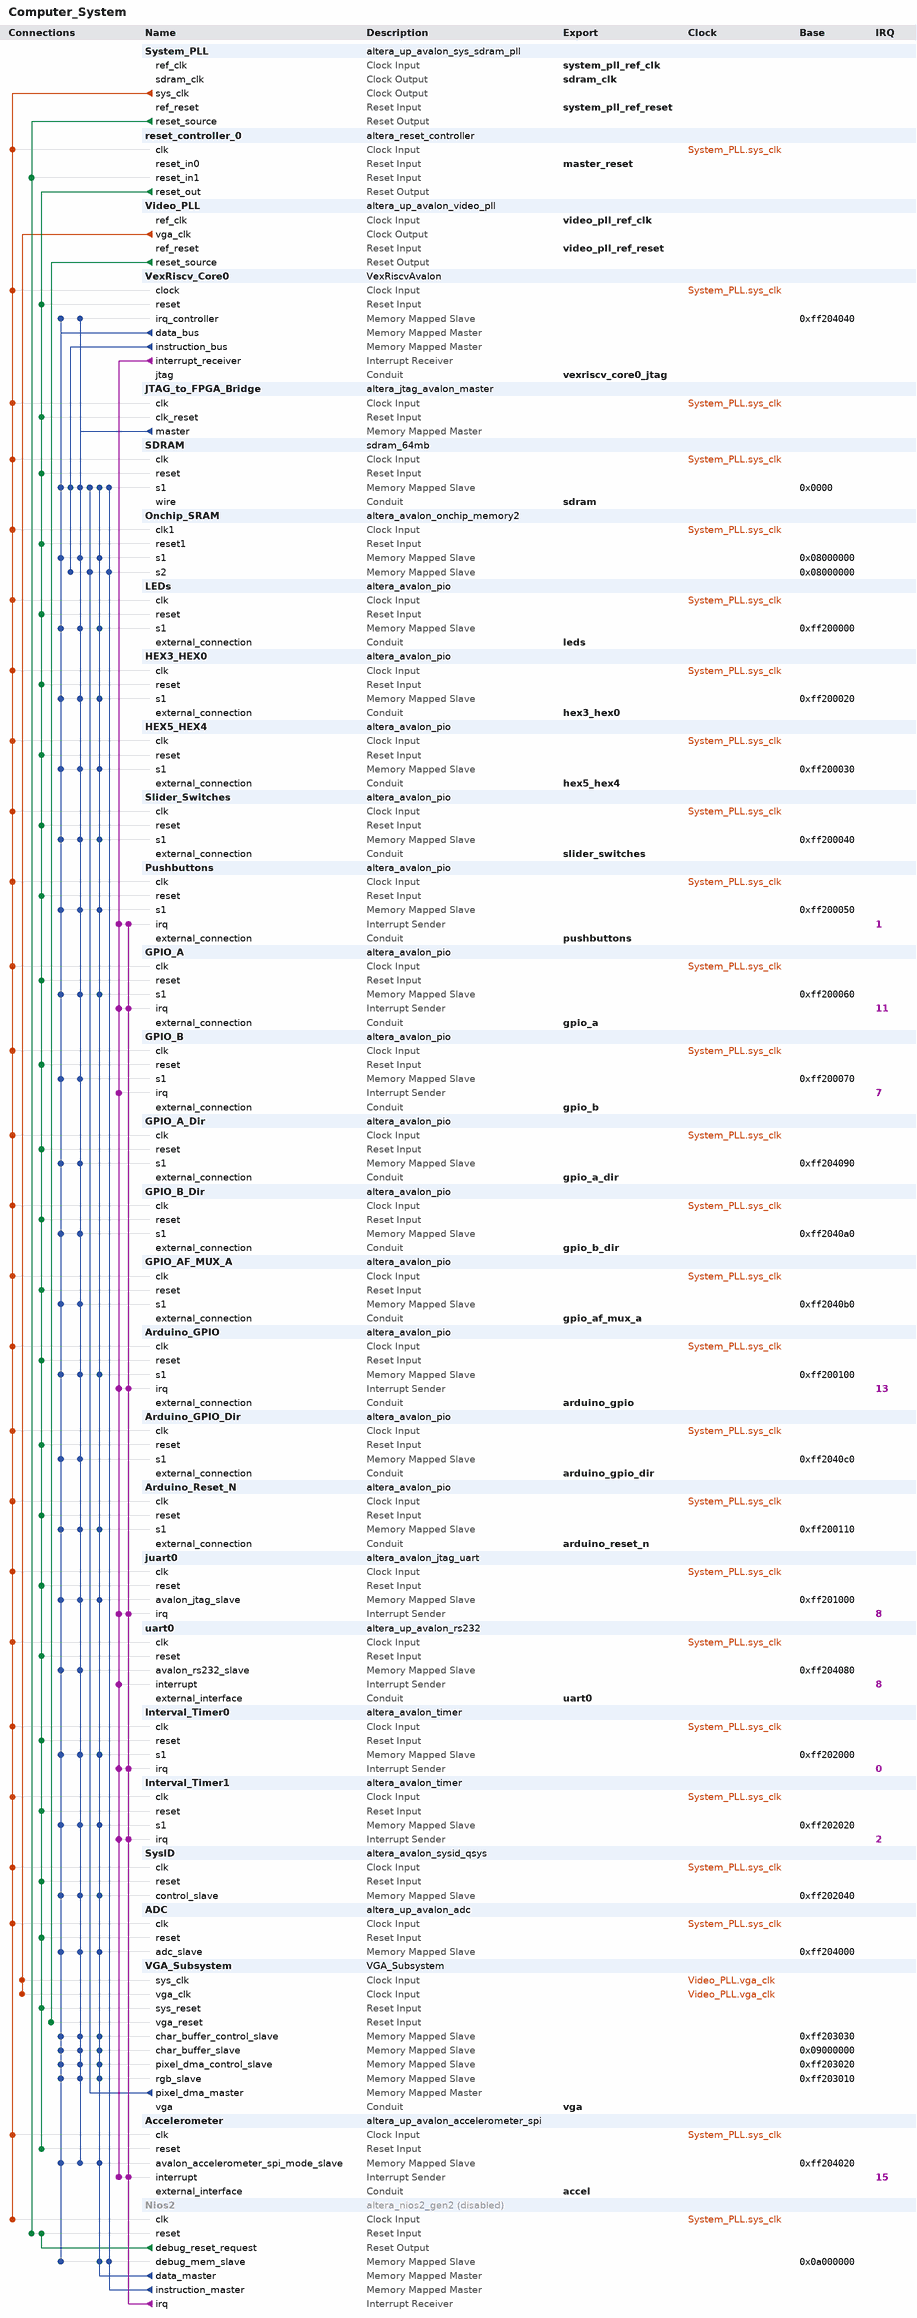
[diagram p0: system contents]
# Platform Designer (Qsys) system Computer_System, MAX 10 10M50DAF484C6GES
# Parameters at their usual value, and those the tool derives, are not listed.
package require -exact qsys 21.1
create_system Computer_System
set_project_property DEVICE_FAMILY {MAX 10}
set_project_property DEVICE 10M50DAF484C6GES

add_instance System_PLL altera_up_avalon_sys_sdram_pll 18.0
set_instance_parameter_value System_PLL CV_boards DE10-Standard
set_instance_parameter_value System_PLL gui_outclk 100.0
set_instance_parameter_value System_PLL gui_refclk 50.0

add_instance reset_controller_0 altera_reset_controller 21.1
set_instance_parameter_value reset_controller_0 NUM_RESET_INPUTS 2
set_instance_parameter_value reset_controller_0 OUTPUT_RESET_SYNC_EDGES both
set_instance_parameter_value reset_controller_0 SYNC_DEPTH 2

add_instance Video_PLL altera_up_avalon_video_pll 18.0
set_instance_parameter_value Video_PLL camera {5MP Digital Camera (THDB_D5M)}
set_instance_parameter_value Video_PLL gui_refclk 50.0
set_instance_parameter_value Video_PLL lcd {7" LCD on VEEK-MT and MTL/MTL2 Modules}

add_instance VexRiscv_Core0 VexRiscvAvalon 1.0
set_instance_parameter_value VexRiscv_Core0 CORE_CONFIG 4
set_instance_parameter_value VexRiscv_Core0 C_EXCEPTION_VECTOR 134217760
set_instance_parameter_value VexRiscv_Core0 C_IO_BEGIN 150994944
set_instance_parameter_value VexRiscv_Core0 C_IO_END 4294967295
set_instance_parameter_value VexRiscv_Core0 C_RESET_VECTOR 134217744

add_instance JTAG_to_FPGA_Bridge altera_jtag_avalon_master 21.1

add_instance SDRAM sdram_64mb 1.0

add_instance Onchip_SRAM altera_avalon_onchip_memory2 21.1
set_instance_parameter_value Onchip_SRAM dataWidth 32
set_instance_parameter_value Onchip_SRAM dualPort true
set_instance_parameter_value Onchip_SRAM initMemContent true
set_instance_parameter_value Onchip_SRAM initializationFileName bootrom.mif
set_instance_parameter_value Onchip_SRAM memorySize 65536
set_instance_parameter_value Onchip_SRAM singleClockOperation true
set_instance_parameter_value Onchip_SRAM useNonDefaultInitFile true

add_instance LEDs altera_avalon_pio 21.1
set_instance_parameter_value LEDs direction Output
set_instance_parameter_value LEDs width 10

add_instance HEX3_HEX0 altera_avalon_pio 21.1
set_instance_parameter_value HEX3_HEX0 direction Output
set_instance_parameter_value HEX3_HEX0 width 32

add_instance HEX5_HEX4 altera_avalon_pio 21.1
set_instance_parameter_value HEX5_HEX4 direction Output
set_instance_parameter_value HEX5_HEX4 width 16

add_instance Slider_Switches altera_avalon_pio 21.1
set_instance_parameter_value Slider_Switches direction Input
set_instance_parameter_value Slider_Switches simDoTestBenchWiring true
set_instance_parameter_value Slider_Switches width 10

add_instance Pushbuttons altera_avalon_pio 21.1
set_instance_parameter_value Pushbuttons bitClearingEdgeCapReg true
set_instance_parameter_value Pushbuttons captureEdge true
set_instance_parameter_value Pushbuttons direction Input
set_instance_parameter_value Pushbuttons edgeType FALLING
set_instance_parameter_value Pushbuttons generateIRQ true
set_instance_parameter_value Pushbuttons irqType EDGE
set_instance_parameter_value Pushbuttons simDoTestBenchWiring true
set_instance_parameter_value Pushbuttons width 2

add_instance GPIO_A altera_avalon_pio 21.1
set_instance_parameter_value GPIO_A bitClearingEdgeCapReg true
set_instance_parameter_value GPIO_A captureEdge true
set_instance_parameter_value GPIO_A direction InOut
set_instance_parameter_value GPIO_A edgeType FALLING
set_instance_parameter_value GPIO_A generateIRQ true
set_instance_parameter_value GPIO_A irqType EDGE
set_instance_parameter_value GPIO_A simDoTestBenchWiring true
set_instance_parameter_value GPIO_A width 32

add_instance GPIO_B altera_avalon_pio 21.1
set_instance_parameter_value GPIO_B bitClearingEdgeCapReg true
set_instance_parameter_value GPIO_B captureEdge true
set_instance_parameter_value GPIO_B direction InOut
set_instance_parameter_value GPIO_B edgeType FALLING
set_instance_parameter_value GPIO_B generateIRQ true
set_instance_parameter_value GPIO_B irqType EDGE
set_instance_parameter_value GPIO_B simDoTestBenchWiring true
set_instance_parameter_value GPIO_B width 32

add_instance GPIO_A_Dir altera_avalon_pio 21.1
set_instance_parameter_value GPIO_A_Dir bitClearingEdgeCapReg true
set_instance_parameter_value GPIO_A_Dir captureEdge true
set_instance_parameter_value GPIO_A_Dir direction Output
set_instance_parameter_value GPIO_A_Dir edgeType FALLING
set_instance_parameter_value GPIO_A_Dir generateIRQ true
set_instance_parameter_value GPIO_A_Dir irqType EDGE
set_instance_parameter_value GPIO_A_Dir simDoTestBenchWiring true
set_instance_parameter_value GPIO_A_Dir width 32

add_instance GPIO_B_Dir altera_avalon_pio 21.1
set_instance_parameter_value GPIO_B_Dir bitClearingEdgeCapReg true
set_instance_parameter_value GPIO_B_Dir captureEdge true
set_instance_parameter_value GPIO_B_Dir direction Output
set_instance_parameter_value GPIO_B_Dir edgeType FALLING
set_instance_parameter_value GPIO_B_Dir generateIRQ true
set_instance_parameter_value GPIO_B_Dir irqType EDGE
set_instance_parameter_value GPIO_B_Dir simDoTestBenchWiring true
set_instance_parameter_value GPIO_B_Dir width 32

add_instance GPIO_AF_MUX_A altera_avalon_pio 21.1
set_instance_parameter_value GPIO_AF_MUX_A bitClearingEdgeCapReg true
set_instance_parameter_value GPIO_AF_MUX_A captureEdge true
set_instance_parameter_value GPIO_AF_MUX_A direction Output
set_instance_parameter_value GPIO_AF_MUX_A edgeType FALLING
set_instance_parameter_value GPIO_AF_MUX_A generateIRQ true
set_instance_parameter_value GPIO_AF_MUX_A irqType EDGE
set_instance_parameter_value GPIO_AF_MUX_A simDoTestBenchWiring true
set_instance_parameter_value GPIO_AF_MUX_A width 32

add_instance Arduino_GPIO altera_avalon_pio 21.1
set_instance_parameter_value Arduino_GPIO bitClearingEdgeCapReg true
set_instance_parameter_value Arduino_GPIO captureEdge true
set_instance_parameter_value Arduino_GPIO direction InOut
set_instance_parameter_value Arduino_GPIO edgeType FALLING
set_instance_parameter_value Arduino_GPIO generateIRQ true
set_instance_parameter_value Arduino_GPIO irqType EDGE
set_instance_parameter_value Arduino_GPIO simDoTestBenchWiring true
set_instance_parameter_value Arduino_GPIO width 32

add_instance Arduino_GPIO_Dir altera_avalon_pio 21.1
set_instance_parameter_value Arduino_GPIO_Dir bitClearingEdgeCapReg true
set_instance_parameter_value Arduino_GPIO_Dir captureEdge true
set_instance_parameter_value Arduino_GPIO_Dir direction Output
set_instance_parameter_value Arduino_GPIO_Dir edgeType FALLING
set_instance_parameter_value Arduino_GPIO_Dir generateIRQ true
set_instance_parameter_value Arduino_GPIO_Dir irqType EDGE
set_instance_parameter_value Arduino_GPIO_Dir simDoTestBenchWiring true
set_instance_parameter_value Arduino_GPIO_Dir width 32

add_instance Arduino_Reset_N altera_avalon_pio 21.1
set_instance_parameter_value Arduino_Reset_N bitClearingEdgeCapReg true
set_instance_parameter_value Arduino_Reset_N captureEdge true
set_instance_parameter_value Arduino_Reset_N direction Output
set_instance_parameter_value Arduino_Reset_N edgeType FALLING
set_instance_parameter_value Arduino_Reset_N width 1

add_instance juart0 altera_avalon_jtag_uart 21.1
set_instance_parameter_value juart0 readBufferDepth 256
set_instance_parameter_value juart0 simInteractiveOptions NO_INTERACTIVE_WINDOWS
set_instance_parameter_value juart0 writeBufferDepth 256

add_instance uart0 altera_up_avalon_rs232 17.1
set_instance_parameter_value uart0 baud 115200
set_instance_parameter_value uart0 parity None

add_instance Interval_Timer0 altera_avalon_timer 21.1
set_instance_parameter_value Interval_Timer0 period 125.0
set_instance_parameter_value Interval_Timer0 periodUnits MSEC

add_instance Interval_Timer1 altera_avalon_timer 21.1
set_instance_parameter_value Interval_Timer1 period 125.0
set_instance_parameter_value Interval_Timer1 periodUnits MSEC

add_instance SysID altera_avalon_sysid_qsys 21.1
set_instance_parameter_value SysID id 0

add_instance ADC altera_up_avalon_adc 18.0
set_instance_parameter_value ADC board DE10-Lite
set_instance_parameter_value ADC numch_ 6
set_instance_parameter_value ADC sclk_freq 10.0

add_instance VGA_Subsystem VGA_Subsystem 1.0

add_instance Accelerometer altera_up_avalon_accelerometer_spi 18.0

add_instance Nios2 altera_nios2_gen2 21.1
set_instance_property Nios2 ENABLED false
set_instance_parameter_value Nios2 dcache_size 0
set_instance_parameter_value Nios2 debug_datatrigger 2
set_instance_parameter_value Nios2 debug_hwbreakpoint 2
set_instance_parameter_value Nios2 debug_traceType instruction_trace
set_instance_parameter_value Nios2 dividerType srt2
set_instance_parameter_value Nios2 exceptionSlave SDRAM.s1
set_instance_parameter_value Nios2 icache_size 4096
set_instance_parameter_value Nios2 impl Fast
set_instance_parameter_value Nios2 mul_64_impl 1
set_instance_parameter_value Nios2 mul_shift_choice 1
set_instance_parameter_value Nios2 resetSlave SDRAM.s1
set_instance_parameter_value Nios2 resetrequest_enabled false
set_instance_parameter_value Nios2 setting_support31bitdcachebypass false

# connections
add_connection System_PLL.sys_clk Accelerometer.clk clock
add_connection System_PLL.sys_clk ADC.clk clock
add_connection System_PLL.sys_clk Arduino_GPIO.clk clock
add_connection System_PLL.sys_clk Arduino_GPIO_Dir.clk clock
add_connection System_PLL.sys_clk Arduino_Reset_N.clk clock
add_connection System_PLL.sys_clk GPIO_A.clk clock
add_connection System_PLL.sys_clk GPIO_A_Dir.clk clock
add_connection System_PLL.sys_clk GPIO_AF_MUX_A.clk clock
add_connection System_PLL.sys_clk GPIO_B.clk clock
add_connection System_PLL.sys_clk GPIO_B_Dir.clk clock
add_connection System_PLL.sys_clk HEX3_HEX0.clk clock
add_connection System_PLL.sys_clk HEX5_HEX4.clk clock
add_connection System_PLL.sys_clk Interval_Timer0.clk clock
add_connection System_PLL.sys_clk Interval_Timer1.clk clock
add_connection System_PLL.sys_clk JTAG_to_FPGA_Bridge.clk clock
add_connection System_PLL.sys_clk juart0.clk clock
add_connection System_PLL.sys_clk LEDs.clk clock
add_connection System_PLL.sys_clk Nios2.clk clock
add_connection System_PLL.sys_clk Onchip_SRAM.clk1 clock
add_connection System_PLL.sys_clk Pushbuttons.clk clock
add_connection System_PLL.sys_clk reset_controller_0.clk clock
add_connection System_PLL.sys_clk SDRAM.clk clock
add_connection System_PLL.sys_clk Slider_Switches.clk clock
add_connection System_PLL.sys_clk SysID.clk clock
add_connection System_PLL.sys_clk uart0.clk clock
add_connection System_PLL.sys_clk VexRiscv_Core0.clock clock
add_connection Video_PLL.vga_clk VGA_Subsystem.sys_clk clock
add_connection Video_PLL.vga_clk VGA_Subsystem.vga_clk clock
add_connection Nios2.debug_reset_request Nios2.reset reset
add_connection reset_controller_0.reset_out Accelerometer.reset reset
add_connection reset_controller_0.reset_out ADC.reset reset
add_connection reset_controller_0.reset_out Arduino_GPIO.reset reset
add_connection reset_controller_0.reset_out Arduino_GPIO_Dir.reset reset
add_connection reset_controller_0.reset_out Arduino_Reset_N.reset reset
add_connection reset_controller_0.reset_out GPIO_A.reset reset
add_connection reset_controller_0.reset_out GPIO_A_Dir.reset reset
add_connection reset_controller_0.reset_out GPIO_AF_MUX_A.reset reset
add_connection reset_controller_0.reset_out GPIO_B.reset reset
add_connection reset_controller_0.reset_out GPIO_B_Dir.reset reset
add_connection reset_controller_0.reset_out HEX3_HEX0.reset reset
add_connection reset_controller_0.reset_out HEX5_HEX4.reset reset
add_connection reset_controller_0.reset_out Interval_Timer0.reset reset
add_connection reset_controller_0.reset_out Interval_Timer1.reset reset
add_connection reset_controller_0.reset_out JTAG_to_FPGA_Bridge.clk_reset reset
add_connection reset_controller_0.reset_out juart0.reset reset
add_connection reset_controller_0.reset_out LEDs.reset reset
add_connection reset_controller_0.reset_out Onchip_SRAM.reset1 reset
add_connection reset_controller_0.reset_out Pushbuttons.reset reset
add_connection reset_controller_0.reset_out SDRAM.reset reset
add_connection reset_controller_0.reset_out Slider_Switches.reset reset
add_connection reset_controller_0.reset_out SysID.reset reset
add_connection reset_controller_0.reset_out uart0.reset reset
add_connection reset_controller_0.reset_out VexRiscv_Core0.reset reset
add_connection reset_controller_0.reset_out VGA_Subsystem.sys_reset reset
add_connection System_PLL.reset_source Nios2.reset reset
add_connection System_PLL.reset_source reset_controller_0.reset_in1 reset
add_connection Video_PLL.reset_source VGA_Subsystem.vga_reset reset
add_connection JTAG_to_FPGA_Bridge.master Accelerometer.avalon_accelerometer_spi_mode_slave avalon
set_connection_parameter_value JTAG_to_FPGA_Bridge.master/Accelerometer.avalon_accelerometer_spi_mode_slave baseAddress 0xff204020
add_connection JTAG_to_FPGA_Bridge.master ADC.adc_slave avalon
set_connection_parameter_value JTAG_to_FPGA_Bridge.master/ADC.adc_slave baseAddress 0xff204000
add_connection JTAG_to_FPGA_Bridge.master Arduino_GPIO.s1 avalon
set_connection_parameter_value JTAG_to_FPGA_Bridge.master/Arduino_GPIO.s1 baseAddress 0xff200100
add_connection JTAG_to_FPGA_Bridge.master Arduino_GPIO_Dir.s1 avalon
set_connection_parameter_value JTAG_to_FPGA_Bridge.master/Arduino_GPIO_Dir.s1 baseAddress 0xff2040c0
add_connection JTAG_to_FPGA_Bridge.master Arduino_Reset_N.s1 avalon
set_connection_parameter_value JTAG_to_FPGA_Bridge.master/Arduino_Reset_N.s1 baseAddress 0xff200110
add_connection JTAG_to_FPGA_Bridge.master GPIO_A.s1 avalon
set_connection_parameter_value JTAG_to_FPGA_Bridge.master/GPIO_A.s1 baseAddress 0xff200060
add_connection JTAG_to_FPGA_Bridge.master GPIO_A_Dir.s1 avalon
set_connection_parameter_value JTAG_to_FPGA_Bridge.master/GPIO_A_Dir.s1 baseAddress 0xff204090
add_connection JTAG_to_FPGA_Bridge.master GPIO_AF_MUX_A.s1 avalon
set_connection_parameter_value JTAG_to_FPGA_Bridge.master/GPIO_AF_MUX_A.s1 baseAddress 0xff2040b0
add_connection JTAG_to_FPGA_Bridge.master GPIO_B.s1 avalon
set_connection_parameter_value JTAG_to_FPGA_Bridge.master/GPIO_B.s1 baseAddress 0xff200070
add_connection JTAG_to_FPGA_Bridge.master GPIO_B_Dir.s1 avalon
set_connection_parameter_value JTAG_to_FPGA_Bridge.master/GPIO_B_Dir.s1 baseAddress 0xff2040a0
add_connection JTAG_to_FPGA_Bridge.master HEX3_HEX0.s1 avalon
set_connection_parameter_value JTAG_to_FPGA_Bridge.master/HEX3_HEX0.s1 baseAddress 0xff200020
add_connection JTAG_to_FPGA_Bridge.master HEX5_HEX4.s1 avalon
set_connection_parameter_value JTAG_to_FPGA_Bridge.master/HEX5_HEX4.s1 baseAddress 0xff200030
add_connection JTAG_to_FPGA_Bridge.master Interval_Timer0.s1 avalon
set_connection_parameter_value JTAG_to_FPGA_Bridge.master/Interval_Timer0.s1 baseAddress 0xff202000
add_connection JTAG_to_FPGA_Bridge.master Interval_Timer1.s1 avalon
set_connection_parameter_value JTAG_to_FPGA_Bridge.master/Interval_Timer1.s1 baseAddress 0xff202020
add_connection JTAG_to_FPGA_Bridge.master juart0.avalon_jtag_slave avalon
set_connection_parameter_value JTAG_to_FPGA_Bridge.master/juart0.avalon_jtag_slave baseAddress 0xff201000
add_connection JTAG_to_FPGA_Bridge.master LEDs.s1 avalon
set_connection_parameter_value JTAG_to_FPGA_Bridge.master/LEDs.s1 baseAddress 0xff200000
add_connection JTAG_to_FPGA_Bridge.master Onchip_SRAM.s1 avalon
set_connection_parameter_value JTAG_to_FPGA_Bridge.master/Onchip_SRAM.s1 baseAddress 0x08000000
add_connection JTAG_to_FPGA_Bridge.master Pushbuttons.s1 avalon
set_connection_parameter_value JTAG_to_FPGA_Bridge.master/Pushbuttons.s1 baseAddress 0xff200050
add_connection JTAG_to_FPGA_Bridge.master SDRAM.s1 avalon
set_connection_parameter_value JTAG_to_FPGA_Bridge.master/SDRAM.s1 baseAddress 0x0000
add_connection JTAG_to_FPGA_Bridge.master Slider_Switches.s1 avalon
set_connection_parameter_value JTAG_to_FPGA_Bridge.master/Slider_Switches.s1 baseAddress 0xff200040
add_connection JTAG_to_FPGA_Bridge.master SysID.control_slave avalon
set_connection_parameter_value JTAG_to_FPGA_Bridge.master/SysID.control_slave baseAddress 0xff202040
add_connection JTAG_to_FPGA_Bridge.master uart0.avalon_rs232_slave avalon
set_connection_parameter_value JTAG_to_FPGA_Bridge.master/uart0.avalon_rs232_slave baseAddress 0xff204080
add_connection JTAG_to_FPGA_Bridge.master VexRiscv_Core0.irq_controller avalon
set_connection_parameter_value JTAG_to_FPGA_Bridge.master/VexRiscv_Core0.irq_controller baseAddress 0xff204040
add_connection JTAG_to_FPGA_Bridge.master VGA_Subsystem.char_buffer_control_slave avalon
set_connection_parameter_value JTAG_to_FPGA_Bridge.master/VGA_Subsystem.char_buffer_control_slave baseAddress 0xff203030
add_connection JTAG_to_FPGA_Bridge.master VGA_Subsystem.char_buffer_slave avalon
set_connection_parameter_value JTAG_to_FPGA_Bridge.master/VGA_Subsystem.char_buffer_slave baseAddress 0x09000000
add_connection JTAG_to_FPGA_Bridge.master VGA_Subsystem.pixel_dma_control_slave avalon
set_connection_parameter_value JTAG_to_FPGA_Bridge.master/VGA_Subsystem.pixel_dma_control_slave baseAddress 0xff203020
add_connection JTAG_to_FPGA_Bridge.master VGA_Subsystem.rgb_slave avalon
set_connection_parameter_value JTAG_to_FPGA_Bridge.master/VGA_Subsystem.rgb_slave baseAddress 0xff203010
add_connection Nios2.data_master Accelerometer.avalon_accelerometer_spi_mode_slave avalon
set_connection_parameter_value Nios2.data_master/Accelerometer.avalon_accelerometer_spi_mode_slave baseAddress 0xff204020
add_connection Nios2.data_master ADC.adc_slave avalon
set_connection_parameter_value Nios2.data_master/ADC.adc_slave baseAddress 0xff204000
add_connection Nios2.data_master Arduino_GPIO.s1 avalon
set_connection_parameter_value Nios2.data_master/Arduino_GPIO.s1 baseAddress 0xff200100
add_connection Nios2.data_master Arduino_Reset_N.s1 avalon
set_connection_parameter_value Nios2.data_master/Arduino_Reset_N.s1 baseAddress 0xff200110
add_connection Nios2.data_master GPIO_A.s1 avalon
set_connection_parameter_value Nios2.data_master/GPIO_A.s1 baseAddress 0xff200060
add_connection Nios2.data_master HEX3_HEX0.s1 avalon
set_connection_parameter_value Nios2.data_master/HEX3_HEX0.s1 baseAddress 0xff200020
add_connection Nios2.data_master HEX5_HEX4.s1 avalon
set_connection_parameter_value Nios2.data_master/HEX5_HEX4.s1 baseAddress 0xff200030
add_connection Nios2.data_master Interval_Timer0.s1 avalon
set_connection_parameter_value Nios2.data_master/Interval_Timer0.s1 baseAddress 0xff202000
add_connection Nios2.data_master Interval_Timer1.s1 avalon
set_connection_parameter_value Nios2.data_master/Interval_Timer1.s1 baseAddress 0xff202020
add_connection Nios2.data_master juart0.avalon_jtag_slave avalon
set_connection_parameter_value Nios2.data_master/juart0.avalon_jtag_slave baseAddress 0xff201000
add_connection Nios2.data_master LEDs.s1 avalon
set_connection_parameter_value Nios2.data_master/LEDs.s1 baseAddress 0xff200000
add_connection Nios2.data_master Nios2.debug_mem_slave avalon
set_connection_parameter_value Nios2.data_master/Nios2.debug_mem_slave baseAddress 0x0a000000
add_connection Nios2.data_master Onchip_SRAM.s1 avalon
set_connection_parameter_value Nios2.data_master/Onchip_SRAM.s1 baseAddress 0x08000000
add_connection Nios2.data_master Pushbuttons.s1 avalon
set_connection_parameter_value Nios2.data_master/Pushbuttons.s1 baseAddress 0xff200050
add_connection Nios2.data_master SDRAM.s1 avalon
set_connection_parameter_value Nios2.data_master/SDRAM.s1 baseAddress 0x0000
add_connection Nios2.data_master Slider_Switches.s1 avalon
set_connection_parameter_value Nios2.data_master/Slider_Switches.s1 baseAddress 0xff200040
add_connection Nios2.data_master SysID.control_slave avalon
set_connection_parameter_value Nios2.data_master/SysID.control_slave baseAddress 0xff202040
add_connection Nios2.data_master VGA_Subsystem.char_buffer_control_slave avalon
set_connection_parameter_value Nios2.data_master/VGA_Subsystem.char_buffer_control_slave baseAddress 0xff203030
add_connection Nios2.data_master VGA_Subsystem.char_buffer_slave avalon
set_connection_parameter_value Nios2.data_master/VGA_Subsystem.char_buffer_slave baseAddress 0x09000000
add_connection Nios2.data_master VGA_Subsystem.pixel_dma_control_slave avalon
set_connection_parameter_value Nios2.data_master/VGA_Subsystem.pixel_dma_control_slave baseAddress 0xff203020
add_connection Nios2.data_master VGA_Subsystem.rgb_slave avalon
set_connection_parameter_value Nios2.data_master/VGA_Subsystem.rgb_slave baseAddress 0xff203010
add_connection Nios2.instruction_master Nios2.debug_mem_slave avalon
set_connection_parameter_value Nios2.instruction_master/Nios2.debug_mem_slave baseAddress 0x0a000000
add_connection Nios2.instruction_master Onchip_SRAM.s2 avalon
set_connection_parameter_value Nios2.instruction_master/Onchip_SRAM.s2 baseAddress 0x08000000
add_connection Nios2.instruction_master SDRAM.s1 avalon
set_connection_parameter_value Nios2.instruction_master/SDRAM.s1 baseAddress 0x0000
add_connection VexRiscv_Core0.data_bus Accelerometer.avalon_accelerometer_spi_mode_slave avalon
set_connection_parameter_value VexRiscv_Core0.data_bus/Accelerometer.avalon_accelerometer_spi_mode_slave baseAddress 0xff204020
add_connection VexRiscv_Core0.data_bus ADC.adc_slave avalon
set_connection_parameter_value VexRiscv_Core0.data_bus/ADC.adc_slave baseAddress 0xff204000
add_connection VexRiscv_Core0.data_bus Arduino_GPIO.s1 avalon
set_connection_parameter_value VexRiscv_Core0.data_bus/Arduino_GPIO.s1 baseAddress 0xff200100
add_connection VexRiscv_Core0.data_bus Arduino_GPIO_Dir.s1 avalon
set_connection_parameter_value VexRiscv_Core0.data_bus/Arduino_GPIO_Dir.s1 baseAddress 0xff2040c0
add_connection VexRiscv_Core0.data_bus Arduino_Reset_N.s1 avalon
set_connection_parameter_value VexRiscv_Core0.data_bus/Arduino_Reset_N.s1 baseAddress 0xff200110
add_connection VexRiscv_Core0.data_bus GPIO_A.s1 avalon
set_connection_parameter_value VexRiscv_Core0.data_bus/GPIO_A.s1 baseAddress 0xff200060
add_connection VexRiscv_Core0.data_bus GPIO_A_Dir.s1 avalon
set_connection_parameter_value VexRiscv_Core0.data_bus/GPIO_A_Dir.s1 baseAddress 0xff204090
add_connection VexRiscv_Core0.data_bus GPIO_AF_MUX_A.s1 avalon
set_connection_parameter_value VexRiscv_Core0.data_bus/GPIO_AF_MUX_A.s1 baseAddress 0xff2040b0
add_connection VexRiscv_Core0.data_bus GPIO_B.s1 avalon
set_connection_parameter_value VexRiscv_Core0.data_bus/GPIO_B.s1 baseAddress 0xff200070
add_connection VexRiscv_Core0.data_bus GPIO_B_Dir.s1 avalon
set_connection_parameter_value VexRiscv_Core0.data_bus/GPIO_B_Dir.s1 baseAddress 0xff2040a0
add_connection VexRiscv_Core0.data_bus HEX3_HEX0.s1 avalon
set_connection_parameter_value VexRiscv_Core0.data_bus/HEX3_HEX0.s1 baseAddress 0xff200020
add_connection VexRiscv_Core0.data_bus HEX5_HEX4.s1 avalon
set_connection_parameter_value VexRiscv_Core0.data_bus/HEX5_HEX4.s1 baseAddress 0xff200030
add_connection VexRiscv_Core0.data_bus Interval_Timer0.s1 avalon
set_connection_parameter_value VexRiscv_Core0.data_bus/Interval_Timer0.s1 baseAddress 0xff202000
add_connection VexRiscv_Core0.data_bus Interval_Timer1.s1 avalon
set_connection_parameter_value VexRiscv_Core0.data_bus/Interval_Timer1.s1 baseAddress 0xff202020
add_connection VexRiscv_Core0.data_bus juart0.avalon_jtag_slave avalon
set_connection_parameter_value VexRiscv_Core0.data_bus/juart0.avalon_jtag_slave baseAddress 0xff201000
add_connection VexRiscv_Core0.data_bus LEDs.s1 avalon
set_connection_parameter_value VexRiscv_Core0.data_bus/LEDs.s1 baseAddress 0xff200000
add_connection VexRiscv_Core0.data_bus Nios2.debug_mem_slave avalon
set_connection_parameter_value VexRiscv_Core0.data_bus/Nios2.debug_mem_slave baseAddress 0x0a000000
add_connection VexRiscv_Core0.data_bus Onchip_SRAM.s1 avalon
set_connection_parameter_value VexRiscv_Core0.data_bus/Onchip_SRAM.s1 baseAddress 0x08000000
add_connection VexRiscv_Core0.data_bus Pushbuttons.s1 avalon
set_connection_parameter_value VexRiscv_Core0.data_bus/Pushbuttons.s1 baseAddress 0xff200050
add_connection VexRiscv_Core0.data_bus SDRAM.s1 avalon
set_connection_parameter_value VexRiscv_Core0.data_bus/SDRAM.s1 baseAddress 0x0000
add_connection VexRiscv_Core0.data_bus Slider_Switches.s1 avalon
set_connection_parameter_value VexRiscv_Core0.data_bus/Slider_Switches.s1 baseAddress 0xff200040
add_connection VexRiscv_Core0.data_bus SysID.control_slave avalon
set_connection_parameter_value VexRiscv_Core0.data_bus/SysID.control_slave baseAddress 0xff202040
add_connection VexRiscv_Core0.data_bus uart0.avalon_rs232_slave avalon
set_connection_parameter_value VexRiscv_Core0.data_bus/uart0.avalon_rs232_slave baseAddress 0xff204080
add_connection VexRiscv_Core0.data_bus VexRiscv_Core0.irq_controller avalon
set_connection_parameter_value VexRiscv_Core0.data_bus/VexRiscv_Core0.irq_controller baseAddress 0xff204040
add_connection VexRiscv_Core0.data_bus VGA_Subsystem.char_buffer_control_slave avalon
set_connection_parameter_value VexRiscv_Core0.data_bus/VGA_Subsystem.char_buffer_control_slave baseAddress 0xff203030
add_connection VexRiscv_Core0.data_bus VGA_Subsystem.char_buffer_slave avalon
set_connection_parameter_value VexRiscv_Core0.data_bus/VGA_Subsystem.char_buffer_slave baseAddress 0x09000000
add_connection VexRiscv_Core0.data_bus VGA_Subsystem.pixel_dma_control_slave avalon
set_connection_parameter_value VexRiscv_Core0.data_bus/VGA_Subsystem.pixel_dma_control_slave baseAddress 0xff203020
add_connection VexRiscv_Core0.data_bus VGA_Subsystem.rgb_slave avalon
set_connection_parameter_value VexRiscv_Core0.data_bus/VGA_Subsystem.rgb_slave baseAddress 0xff203010
add_connection VexRiscv_Core0.instruction_bus Onchip_SRAM.s2 avalon
set_connection_parameter_value VexRiscv_Core0.instruction_bus/Onchip_SRAM.s2 baseAddress 0x08000000
add_connection VexRiscv_Core0.instruction_bus SDRAM.s1 avalon
set_connection_parameter_value VexRiscv_Core0.instruction_bus/SDRAM.s1 baseAddress 0x0000
add_connection VGA_Subsystem.pixel_dma_master Onchip_SRAM.s2 avalon
set_connection_parameter_value VGA_Subsystem.pixel_dma_master/Onchip_SRAM.s2 baseAddress 0x08000000
add_connection VGA_Subsystem.pixel_dma_master SDRAM.s1 avalon
set_connection_parameter_value VGA_Subsystem.pixel_dma_master/SDRAM.s1 baseAddress 0x0000
add_connection Nios2.irq Accelerometer.interrupt interrupt
set_connection_parameter_value Nios2.irq/Accelerometer.interrupt irqNumber 15
add_connection Nios2.irq Arduino_GPIO.irq interrupt
set_connection_parameter_value Nios2.irq/Arduino_GPIO.irq irqNumber 13
add_connection Nios2.irq GPIO_A.irq interrupt
set_connection_parameter_value Nios2.irq/GPIO_A.irq irqNumber 11
add_connection Nios2.irq Interval_Timer0.irq interrupt
set_connection_parameter_value Nios2.irq/Interval_Timer0.irq irqNumber 0
add_connection Nios2.irq Interval_Timer1.irq interrupt
set_connection_parameter_value Nios2.irq/Interval_Timer1.irq irqNumber 2
add_connection Nios2.irq juart0.irq interrupt
set_connection_parameter_value Nios2.irq/juart0.irq irqNumber 8
add_connection Nios2.irq Pushbuttons.irq interrupt
set_connection_parameter_value Nios2.irq/Pushbuttons.irq irqNumber 1
add_connection VexRiscv_Core0.interrupt_receiver Accelerometer.interrupt interrupt
set_connection_parameter_value VexRiscv_Core0.interrupt_receiver/Accelerometer.interrupt irqNumber 0
add_connection VexRiscv_Core0.interrupt_receiver Arduino_GPIO.irq interrupt
set_connection_parameter_value VexRiscv_Core0.interrupt_receiver/Arduino_GPIO.irq irqNumber 1
add_connection VexRiscv_Core0.interrupt_receiver GPIO_A.irq interrupt
set_connection_parameter_value VexRiscv_Core0.interrupt_receiver/GPIO_A.irq irqNumber 2
add_connection VexRiscv_Core0.interrupt_receiver GPIO_B.irq interrupt
set_connection_parameter_value VexRiscv_Core0.interrupt_receiver/GPIO_B.irq irqNumber 7
add_connection VexRiscv_Core0.interrupt_receiver Interval_Timer0.irq interrupt
set_connection_parameter_value VexRiscv_Core0.interrupt_receiver/Interval_Timer0.irq irqNumber 3
add_connection VexRiscv_Core0.interrupt_receiver Interval_Timer1.irq interrupt
set_connection_parameter_value VexRiscv_Core0.interrupt_receiver/Interval_Timer1.irq irqNumber 4
add_connection VexRiscv_Core0.interrupt_receiver juart0.irq interrupt
set_connection_parameter_value VexRiscv_Core0.interrupt_receiver/juart0.irq irqNumber 5
add_connection VexRiscv_Core0.interrupt_receiver Pushbuttons.irq interrupt
set_connection_parameter_value VexRiscv_Core0.interrupt_receiver/Pushbuttons.irq irqNumber 6
add_connection VexRiscv_Core0.interrupt_receiver uart0.interrupt interrupt
set_connection_parameter_value VexRiscv_Core0.interrupt_receiver/uart0.interrupt irqNumber 8

# exported interfaces
add_interface accel conduit end
set_interface_property accel EXPORT_OF Accelerometer.external_interface
add_interface arduino_gpio conduit end
set_interface_property arduino_gpio EXPORT_OF Arduino_GPIO.external_connection
add_interface arduino_gpio_dir conduit end
set_interface_property arduino_gpio_dir EXPORT_OF Arduino_GPIO_Dir.external_connection
add_interface arduino_reset_n conduit end
set_interface_property arduino_reset_n EXPORT_OF Arduino_Reset_N.external_connection
add_interface gpio_a conduit end
set_interface_property gpio_a EXPORT_OF GPIO_A.external_connection
add_interface gpio_a_dir conduit end
set_interface_property gpio_a_dir EXPORT_OF GPIO_A_Dir.external_connection
add_interface gpio_af_mux_a conduit end
set_interface_property gpio_af_mux_a EXPORT_OF GPIO_AF_MUX_A.external_connection
add_interface gpio_b conduit end
set_interface_property gpio_b EXPORT_OF GPIO_B.external_connection
add_interface gpio_b_dir conduit end
set_interface_property gpio_b_dir EXPORT_OF GPIO_B_Dir.external_connection
add_interface hex3_hex0 conduit end
set_interface_property hex3_hex0 EXPORT_OF HEX3_HEX0.external_connection
add_interface hex5_hex4 conduit end
set_interface_property hex5_hex4 EXPORT_OF HEX5_HEX4.external_connection
add_interface leds conduit end
set_interface_property leds EXPORT_OF LEDs.external_connection
add_interface master_reset reset sink
set_interface_property master_reset EXPORT_OF reset_controller_0.reset_in0
add_interface pushbuttons conduit end
set_interface_property pushbuttons EXPORT_OF Pushbuttons.external_connection
add_interface sdram conduit end
set_interface_property sdram EXPORT_OF SDRAM.wire
add_interface sdram_clk clock source
set_interface_property sdram_clk EXPORT_OF System_PLL.sdram_clk
add_interface slider_switches conduit end
set_interface_property slider_switches EXPORT_OF Slider_Switches.external_connection
add_interface system_pll_ref_clk clock sink
set_interface_property system_pll_ref_clk EXPORT_OF System_PLL.ref_clk
add_interface system_pll_ref_reset reset sink
set_interface_property system_pll_ref_reset EXPORT_OF System_PLL.ref_reset
add_interface uart0 conduit end
set_interface_property uart0 EXPORT_OF uart0.external_interface
add_interface vexriscv_core0_jtag conduit end
set_interface_property vexriscv_core0_jtag EXPORT_OF VexRiscv_Core0.jtag
add_interface vga conduit end
set_interface_property vga EXPORT_OF VGA_Subsystem.vga
add_interface video_pll_ref_clk clock sink
set_interface_property video_pll_ref_clk EXPORT_OF Video_PLL.ref_clk
add_interface video_pll_ref_reset reset sink
set_interface_property video_pll_ref_reset EXPORT_OF Video_PLL.ref_reset

set_interconnect_requirement {$system} qsys_mm.clockCrossingAdapter HANDSHAKE
set_interconnect_requirement {$system} qsys_mm.enableEccProtection FALSE
set_interconnect_requirement {$system} qsys_mm.insertDefaultSlave FALSE
set_interconnect_requirement {$system} qsys_mm.maxAdditionalLatency 1

save_system Computer_System.qsys
